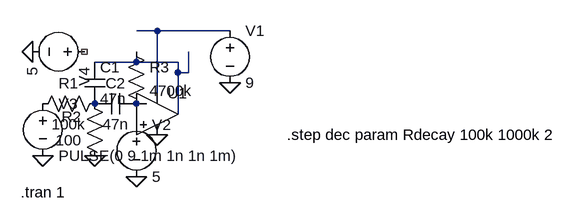
[diagram p0: schematic ResonantBPforDrum2020.asc]
ResonantBPforDrum2020.asc, the LTspice schematic file:
Version 4
SHEET 1 880 680
WIRE 192 -160 160 -160
WIRE 304 -160 192 -160
WIRE 160 -112 160 -128
WIRE 160 -112 96 -112
WIRE 224 -112 160 -112
WIRE 224 -96 224 -112
WIRE 240 -96 240 -128
WIRE 240 -96 224 -96
WIRE 192 -64 192 -160
WIRE 224 -32 224 -96
FLAG 304 -80 0
FLAG 192 0 0
FLAG 96 32 0
FLAG 160 64 0
FLAG 16 32 0
FLAG 0 -128 0
SYMBOL voltage 304 -176 R0
WINDOW 123 0 0 Left 0
WINDOW 39 0 0 Left 0
SYMATTR InstName V1
SYMATTR Value 9
SYMBOL Opamps\\UniversalOpamp2 192 -32 R0
SYMATTR InstName U1
SYMBOL res 112 -64 R90
WINDOW 0 0 56 VBottom 2
WINDOW 3 32 56 VTop 2
SYMATTR InstName R1
SYMATTR Value 100k
SYMBOL res 112 48 R180
WINDOW 0 36 76 Left 2
WINDOW 3 36 40 Left 2
SYMATTR InstName R2
SYMATTR Value 100
SYMBOL cap 80 -112 R0
SYMATTR InstName C1
SYMATTR Value 47n
SYMBOL cap 160 -64 R90
WINDOW 0 0 32 VBottom 2
WINDOW 3 32 32 VTop 2
SYMATTR InstName C2
SYMATTR Value 47n
SYMBOL voltage 160 -32 R0
WINDOW 123 0 0 Left 0
WINDOW 39 0 0 Left 0
SYMATTR InstName V2
SYMATTR Value 5
SYMBOL voltage 16 -64 R0
WINDOW 123 0 0 Left 0
WINDOW 39 0 0 Left 0
SYMATTR InstName V3
SYMATTR Value PULSE(0 9 1m 1n 1n 1m)
SYMBOL res 144 -144 R0
SYMATTR InstName R3
SYMATTR Value 4700k
SYMBOL voltage 96 -128 R90
WINDOW 123 0 0 Left 0
WINDOW 39 0 0 Left 0
SYMATTR InstName V4
SYMATTR Value 5
TEXT -18 88 Left 2 !.tran 1
TEXT 392 0 Left 2 !.step dec param Rdecay 100k 1000k 2

The netlist it stands for:
* ResonantBPforDrum2020.asc
V1 N001 0 9
XU1 P001 P002 N001 0 N002 level.2 Avol=1Meg GBW=10Meg Slew=10Meg ilimit=25m rail=0 Vos=0 phimargin=45 en=0 enk=0 in=0 ink=0 Rin=500Meg  ; pins IN+ IN- V+ V- OUT
R1 P003 P004 100k
R2 0 P003 100
C1 N002 P003 47n
C2 P002 P003 47n
V2 P001 0 5
V3 P004 0 PULSE(0 9 1m 1n 1n 1m)
R3 N002 P002 4700k
V4 NC_01 0 5
.tran 1
.step dec param Rdecay 100k 1000k 2
.lib UniversalOpamps2.sub
.backanno
.end